# Altium project FAR_SMALL.PrjPcb
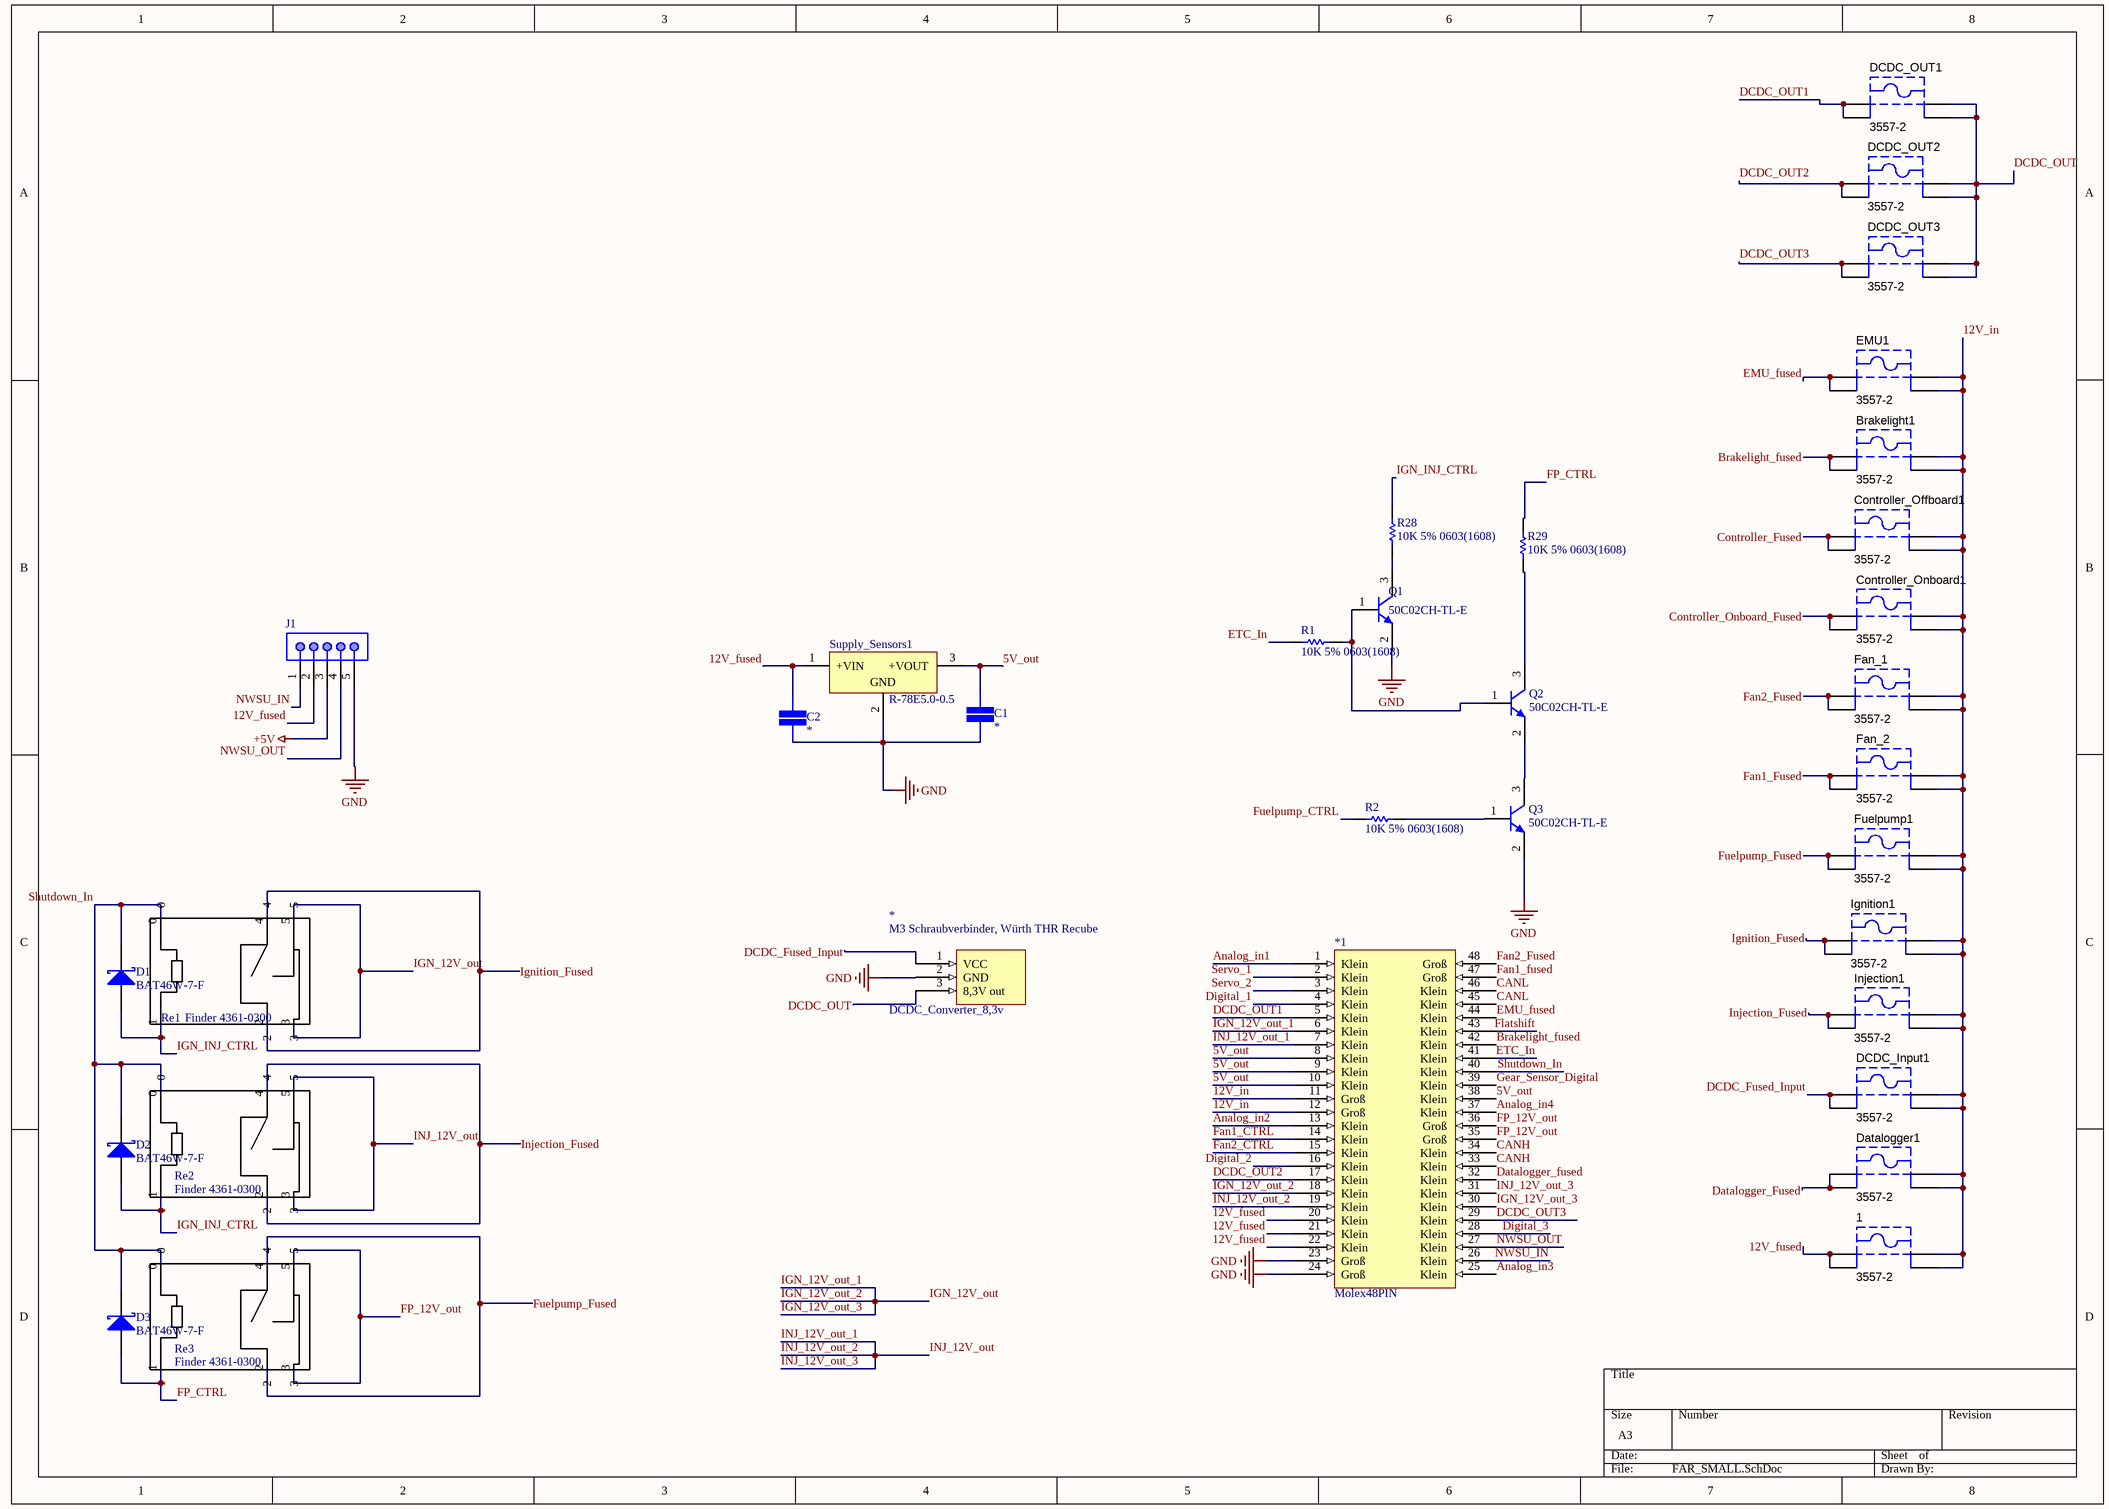
[diagram p0: FAR_SMALL.SchDoc]
3 sheets, 99 parts. Net scope: global (net labels, ports and power ports of the same name join across sheets).
Board file: FAR_Small_PCB_V1_0.PcbDoc
Sheets:
  FAR_SMALL.SchDoc
  Fused_Inputs.SchDoc
  Controller.SchDoc

## Sheet FAR_SMALL.SchDoc
size A3

### Parts
1  3557-2  [KSTN-3557-2]
*  DCDC_Converter_8,3v  [DCDC_BR_8,3V]
*1  Molex48PIN  [PCBComponent_1]
Brakelight1  3557-2  [KSTN-3557-2]
C1  SMD Capacitor  [CAP 0603/1608]  (value not drawn)
C2  SMD Capacitor  [CAP 0603/1608]  (value not drawn)
Controller_Offboard1  3557-2  [KSTN-3557-2]
Controller_Onboard1  3557-2  [KSTN-3557-2]
D1  BAT46W-7-F  [DIOD-SOD-123-2_V]
D2  BAT46W-7-F  [DIOD-SOD-123-2_V]
D3  BAT46W-7-F  [DIOD-SOD-123-2_V]
Datalogger1  3557-2  [KSTN-3557-2]
DCDC_Input1  3557-2  [KSTN-3557-2]
DCDC_OUT1  3557-2  [KSTN-3557-2]
DCDC_OUT2  3557-2  [KSTN-3557-2]
DCDC_OUT3  3557-2  [KSTN-3557-2]
EMU1  3557-2  [KSTN-3557-2]
Fan_1  3557-2  [KSTN-3557-2]
Fan_2  3557-2  [KSTN-3557-2]
Fuelpump1  3557-2  [KSTN-3557-2]
Ignition1  3557-2  [KSTN-3557-2]
Injection1  3557-2  [KSTN-3557-2]
J1  61300511121  [61300511121]  (value not drawn)
Q1  50C02CH-TL-E  [ONSC-CPH-3_V]
Q2  50C02CH-TL-E  [ONSC-CPH-3_V]
Q3  50C02CH-TL-E  [ONSC-CPH-3_V]
R1  10K 5% 0603(1608)  [RESC0603(1608)_N]
R2  10K 5% 0603(1608)  [RESC0603(1608)_N]
R28  10K 5% 0603(1608)  [RESC0603(1608)_N]
R29  10K 5% 0603(1608)  [RESC0603(1608)_N]
Re1  Finder 4361-0300  [Finder 436190120300]
Re2  Finder 4361-0300  [Finder 436190120300]
Re3  Finder 4361-0300  [Finder 436190120300]
Supply_Sensors1  R-78E5.0-0.5  [REPO-R-78E-0.5-3_V]

### Nets
+5V: J1.3
GND: *.2(GND) *1.23(Groß) *1.24(Groß) C1.1 C2.1 J1.5 Q1.2(E) Q3.2(E) Supply_Sensors1.2(GND)
5V_out: *1.8(Klein) *1.9(Klein) *1.10(Klein) *1.38(Klein) C1.2 Supply_Sensors1.3(+VOUT)
12V_fused: 1.1 1.2 *1.20(Klein) *1.21(Klein) *1.22(Klein) C2.2 J1.2 Supply_Sensors1.1(+VIN)
12V_in: 1.3 1.4 *1.11(Groß) *1.12(Groß) Brakelight1.3 Brakelight1.4 Controller_Offboard1.3 Controller_Offboard1.4 Controller_Onboard1.3 Controller_Onboard1.4 Datalogger1.3 Datalogger1.4 DCDC_Input1.3 DCDC_Input1.4 EMU1.3 EMU1.4 Fan_1.3 Fan_1.4 Fan_2.3 Fan_2.4 Fuelpump1.3 Fuelpump1.4 Ignition1.3 Ignition1.4 Injection1.3 Injection1.4
Analog_in1: *1.1(Klein)
Analog_in2: *1.13(Klein)
Analog_in3: *1.25(Klein)
Analog_in4: *1.37(Klein)
Brakelight_fused: *1.42(Klein) Brakelight1.1 Brakelight1.2
CANH: *1.33(Klein) *1.34(Klein)
CANL: *1.45(Klein) *1.46(Klein)
Controller_Fused: Controller_Offboard1.1 Controller_Offboard1.2
Controller_Onboard_Fused: Controller_Onboard1.1 Controller_Onboard1.2
Datalogger_Fused: *1.32(Klein) Datalogger1.1 Datalogger1.2
DCDC_Fused_Input: *.1(VCC) DCDC_Input1.1 DCDC_Input1.2
DCDC_OUT: *.3(8,3V_out) DCDC_OUT1.3 DCDC_OUT1.4 DCDC_OUT2.3 DCDC_OUT2.4 DCDC_OUT3.3 DCDC_OUT3.4
DCDC_OUT1: *1.5(Klein) DCDC_OUT1.1 DCDC_OUT1.2
DCDC_OUT2: *1.17(Klein) DCDC_OUT2.1 DCDC_OUT2.2
DCDC_OUT3: *1.29(Klein) DCDC_OUT3.1 DCDC_OUT3.2
Digital_1: *1.4(Klein)
Digital_2: *1.16(Klein)
Digital_3: *1.28(Klein)
EMU_fused: *1.44(Klein) EMU1.1 EMU1.2
ETC_In: *1.41(Klein) R1.1
Fan1_CTRL: *1.14(Klein)
Fan1_Fused: *1.47(Groß) Fan_2.1 Fan_2.2
Fan2_CTRL: *1.15(Klein)
Fan2_Fused: *1.48(Groß) Fan_1.1 Fan_1.2
Flatshift: *1.43(Klein)
FP_12V_out: *1.35(Groß) *1.36(Groß) Re3.3 Re3.5
FP_CTRL: D3.1(A) R29.2 Re3.1
Fuelpump_CTRL: R2.1
Fuelpump_Fused: Fuelpump1.1 Fuelpump1.2 Re3.2 Re3.4
Gear_Sensor_Digital: *1.39(Klein)
IGN_12V_out: *1.6(Klein) *1.18(Klein) *1.30(Klein) Re1.3 Re1.5  [also labelled IGN_12V_out_1, IGN_12V_out_2, IGN_12V_out_3]
IGN_INJ_CTRL: D1.1(A) D2.1(A) R28.2 Re1.1 Re2.1
Ignition_Fused: Ignition1.1 Ignition1.2 Re1.2 Re1.4
INJ_12V_out: *1.7(Klein) *1.19(Klein) *1.31(Klein) Re2.3 Re2.5  [also labelled INJ_12V_out_1, INJ_12V_out_2, INJ_12V_out_3]
Injection_Fused: Injection1.1 Injection1.2 Re2.2 Re2.4
NWSU_IN: *1.26(Klein) J1.1
NWSU_OUT: *1.27(Klein) J1.4
Servo_1: *1.2(Klein)
Servo_2: *1.3(Klein)
Shutdown_In: *1.40(Klein) D1.2(K) D2.2(K) D3.2(K) Re1.0 Re2.0 Re3.0
NetQ1_1: Q1.1(B) Q2.1(B) R1.2
NetQ1_3: Q1.3(C) R28.1
NetQ2_2: Q2.2(E) Q3.3(C)
NetQ2_3: Q2.3(C) R29.1
NetQ3_1: Q3.1(B) R2.2

### Notes on the sheet
- (in symbol DCDC_Converter_8,3v) M3 Schraubverbinder, Würth THR Recube

### Library data of the parts
1 Brakelight1 Controller_Offboard1 Controller_Onboard1 Datalogger1 DCDC_Input1 DCDC_OUT1-DCDC_OUT3 EMU1 Fan_1 Fan_2 Fuelpump1 Ignition1 Injection1 = CMP-2000-05461-1: FUSE HOLDER, PCB MOUNT, 500VAC, 20A, ROHS; Manufacturer: Keystone-Electronics; Number of Circuits: 1; Voltage: 500V; Fuseholder Type: Block; Fuse Type: Blade; Fuse Size: 0.43"Lx0.15"Wx0.64"H(10.92mmx3.81mmx16.25mm); For Use With/Related Products: ATC,ATO257,MINI897; Current Rating: 30A; Datasheet URL: http://datasheet.octopart.com/3557-2-Keystone-datasheet-15715937.pdf; Orientation: Vertical; Family: Fuseholders; Datasheet Version: Apr-13; Contact Finish: TinNickel; Mounting Type: PCB; Series: -; Category: CircuitProtection; Termination Style: PCPin; Contact Material: Brass; Manufacturer URL: http://www.keyelco.com/
C1 C2 = SMD Capacitor: Capacitor with multiple Footprints; Value: *
D1-D3 = CMP-0303-00004-1: Surface Mount Schottky Barrier Diode, 100 V, -55 to 125 degC, 2-Pin SOD123, RoHS, Tape and Reel; Manufacturer: Diodes Inc; IR@1.5 V: 0.3 uA Max.; V(BR)R: 100 V Min.; VF@10 mA: 0.45 V Max.; CT@1 V: 12 pF Typ.; PartNumber: BAT46W-7-F; ComponentLink1URL: http://www.diodes.com/; ComponentLink3URL: http://diodes.com/datasheets/ds30044.pdf; PackageDescription: 2-Pin SMD, Body 2.7 x 1.55 mm, Height 1.45 mm; ComponentLink2Description: Datasheet; ComponentLink3Description: Package Specification; Mounting Technology: Surface Mount; ComponentLink1Description: Manufacturer URL; RoHS: TRUE; Operating Temperature: -55 to 125 degC; Packing: Tape and Reel; ComponentLink2URL: http://diodes.com/datasheets/ds30044.pdf; DatasheetVersion: Rev. 16-2
J1 = 61300511121: WR-PHD Pin Header, THT, pitch 2.54mm, Single Row, Vertical, 5pin; Pin Number: 5; Gender: Male; Rated Current: 3A; Working Voltage: 250VAC; Withstanding Voltage: 500VAC; Contact Resistance: 20mOhm; ComponentLink1Description: Manufacturer; ComponentLink1URL: http://www.we-online.de; ComponentLink2Description: Datasheet; ComponentLink2URL: https://katalog.we-online.de/em/datasheet/6130xx11121.pdf; Part Number: 61300511121; Published Date: June 2019; Publisher: Wurth Elektronik; Pitch: 2.54mm; Operating Temperature: -40 to +105degC; Mounting Technology: THT; Packaging: Bag; Row Number: Single; Orientation: Vertical
Q1-Q3 = CMP-1048-00075-1: Bipolar Transistor, 50 V, 0.5 A, Low VCE(sat), NPN Single, 3-Pin CPH, Pb-Free, Tape and Reel; Manufacturer: On Semiconductor; IC Continuous (A): 0.5; Polarity: NPN; ComponentLink2Description: Datasheet; ComponentLink1URL: http://www.onsemi.com/; PartNumber: 50C02CH-TL-E; ComponentLink1Description: Manufacturer URL; PackageReference: CPH-3; Mounting Technology: Surface Mount; ComponentLink2URL: http://www.onsemi.com/pub_link/Collateral/50C02CH-D.PDF; PackageDescription: 3-Pin Small Outline Transistor, Body 2.9 x 1.6 mm, Pitch 0.95 mm; ComponentLink3Description: Package Specification; ComponentLink3URL: http://www.onsemi.com/pub_link/Collateral/50A02CH-D.PDF; Packing: Tape and Reel; RoHS: TRUE
R1 R2 R28 R29 = CMP-1012-00098-1: 10K 0.1W 5% 0603 (1608 Metric)  SMD; Case-EIA: 0603; Value: 10000.00 Ohm; Case-Metric: 1608; Technology: SMT; Tolerance: 5 %; Power: 0.1 W
Re1-Re3 = Finder 4361-0300: 1 Schließer, 16A; pin to pad: 0>1 1>2 2>3 3>4 4>5 5>6
Supply_Sensors1 = CMP-2000-06922-2: DC/DC-Converter, 5 V Single Output, 500 mA, -40 to 85 degC, 3-Pin THD, RoHS, Tube; Manufacturer: Recom Power; Efficiency: 92%; Number of Outputs: 1; Current - Output (Max): 500mA; VIN Min: 7V; Package Version: Rev. 0; VIN Max: 28V; VOUT: 5V; Manufacturer URL: http://www.recom-power.com/us/americas/home.html; Operating Temperature: -40°C~85°C; Datasheet Version: 01/2017; Packaging: Tube; Package Reference: SIP Module; Datasheet URL: http://www.recom-power.com/pdf/Innoline/R-78Exx-0.5.pdf; Package Description: 3-Pin Through Hole Device, Body 11.6 x 8.5 mm, Pitch 2.54 mm; Mounting Technology: ThroughHole

## Sheet Fused_Inputs.SchDoc
size A4
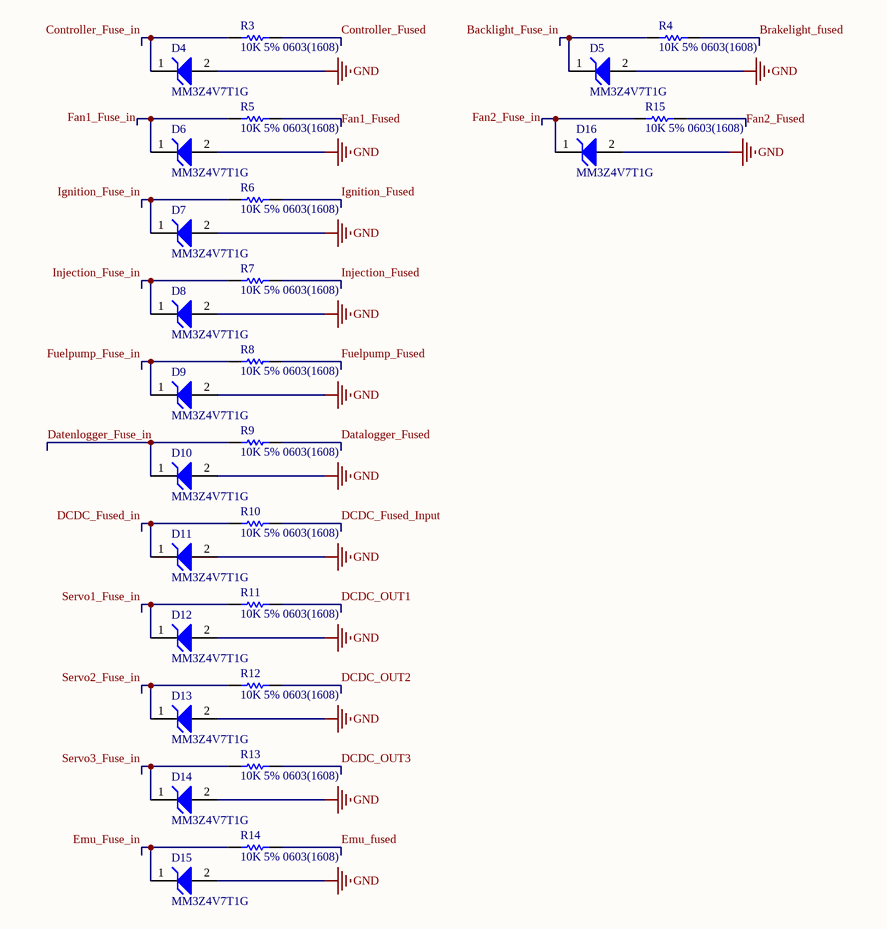
[diagram p1: Fused_Inputs.SchDoc]

### Parts
D4  MM3Z4V7T1G  [ONSC-SOD-323-2-477-02_V]
D5  MM3Z4V7T1G  [ONSC-SOD-323-2-477-02_V]
D6  MM3Z4V7T1G  [ONSC-SOD-323-2-477-02_V]
D7  MM3Z4V7T1G  [ONSC-SOD-323-2-477-02_V]
D8  MM3Z4V7T1G  [ONSC-SOD-323-2-477-02_V]
D9  MM3Z4V7T1G  [ONSC-SOD-323-2-477-02_V]
D10  MM3Z4V7T1G  [ONSC-SOD-323-2-477-02_V]
D11  MM3Z4V7T1G  [ONSC-SOD-323-2-477-02_V]
D12  MM3Z4V7T1G  [ONSC-SOD-323-2-477-02_V]
D13  MM3Z4V7T1G  [ONSC-SOD-323-2-477-02_V]
D14  MM3Z4V7T1G  [ONSC-SOD-323-2-477-02_V]
D15  MM3Z4V7T1G  [ONSC-SOD-323-2-477-02_V]
D16  MM3Z4V7T1G  [ONSC-SOD-323-2-477-02_V]
R3  10K 5% 0603(1608)  [RESC0603(1608)_N]
R4  10K 5% 0603(1608)  [RESC0603(1608)_N]
R5  10K 5% 0603(1608)  [RESC0603(1608)_N]
R6  10K 5% 0603(1608)  [RESC0603(1608)_N]
R7  10K 5% 0603(1608)  [RESC0603(1608)_N]
R8  10K 5% 0603(1608)  [RESC0603(1608)_N]
R9  10K 5% 0603(1608)  [RESC0603(1608)_N]
R10  10K 5% 0603(1608)  [RESC0603(1608)_N]
R11  10K 5% 0603(1608)  [RESC0603(1608)_N]
R12  10K 5% 0603(1608)  [RESC0603(1608)_N]
R13  10K 5% 0603(1608)  [RESC0603(1608)_N]
R14  10K 5% 0603(1608)  [RESC0603(1608)_N]
R15  10K 5% 0603(1608)  [RESC0603(1608)_N]

### Nets
GND: D4.2(A) D5.2(A) D6.2(A) D7.2(A) D8.2(A) D9.2(A) D10.2(A) D11.2(A) D12.2(A) D13.2(A) D14.2(A) D15.2(A) D16.2(A)
Backlight_Fuse_in: D5.1(K) R4.1
Brakelight_fused: R4.2
Controller_Fuse_in: D4.1(K) R3.1
Controller_Fused: R3.2
Datalogger_Fused: R9.2
Datenlogger_Fuse_in: D10.1(K) R9.1
DCDC_Fused_in: D11.1(K) R10.1
DCDC_Fused_Input: R10.2
DCDC_OUT1: R11.2
DCDC_OUT2: R12.2
DCDC_OUT3: R13.2
Emu_Fuse_in: D15.1(K) R14.1
EMU_fused: R14.2
Fan1_Fuse_in: D6.1(K) R5.1
Fan1_Fused: R5.2
Fan2_Fuse_in: D16.1(K) R15.1
Fan2_Fused: R15.2
Fuelpump_Fuse_in: D9.1(K) R8.1
Fuelpump_Fused: R8.2
Ignition_Fuse_in: D7.1(K) R6.1
Ignition_Fused: R6.2
Injection_Fuse_in: D8.1(K) R7.1
Injection_Fused: R7.2
Servo1_Fuse_in: D12.1(K) R11.1
Servo2_Fuse_in: D13.1(K) R12.1
Servo3_Fuse_in: D14.1(K) R13.1

### Library data of the parts
D4-D16 = CMP-1060-00657-1: Zener Voltage Regulator, 300 mW, 2-Pin SOD-323, Pb-Free, Tape and Reel; Manufacturer: On Semiconductor; VZ Typ (V): 4.7; P Max (W): 0.3; ComponentLink1Description: Manufacturer URL; PackageVersion: Rev. H, 03/2007; RoHS: Pb-Free; PackageReference: SOD-323-2-477-02; DatasheetVersion: Rev. 9; ComponentLink1URL: http://www.onsemi.com/; ComponentLink2Description: Datasheet; PartNumber: MM3Z4V7T1G; Mounting Technology: Surface Mount; ComponentLink2URL: http://www.onsemi.cn/pub_link/Collateral/MM3Z2V4T1-D.PDF; PackageDescription: 2-Pin SOD, Body 1.7 x 1.25 mm; Packing: Tape and Reel; ComponentLink3Description: Package Specification; ComponentLink3URL: http://www.onsemi.com/pub_link/Collateral/477-02.PDF.1
R3-R15 = CMP-1012-00098-1: as R1 on sheet FAR_SMALL; Technology: SMT; Tolerance: 5 %; Power: 0.1 W

## Sheet Controller.SchDoc
size A3
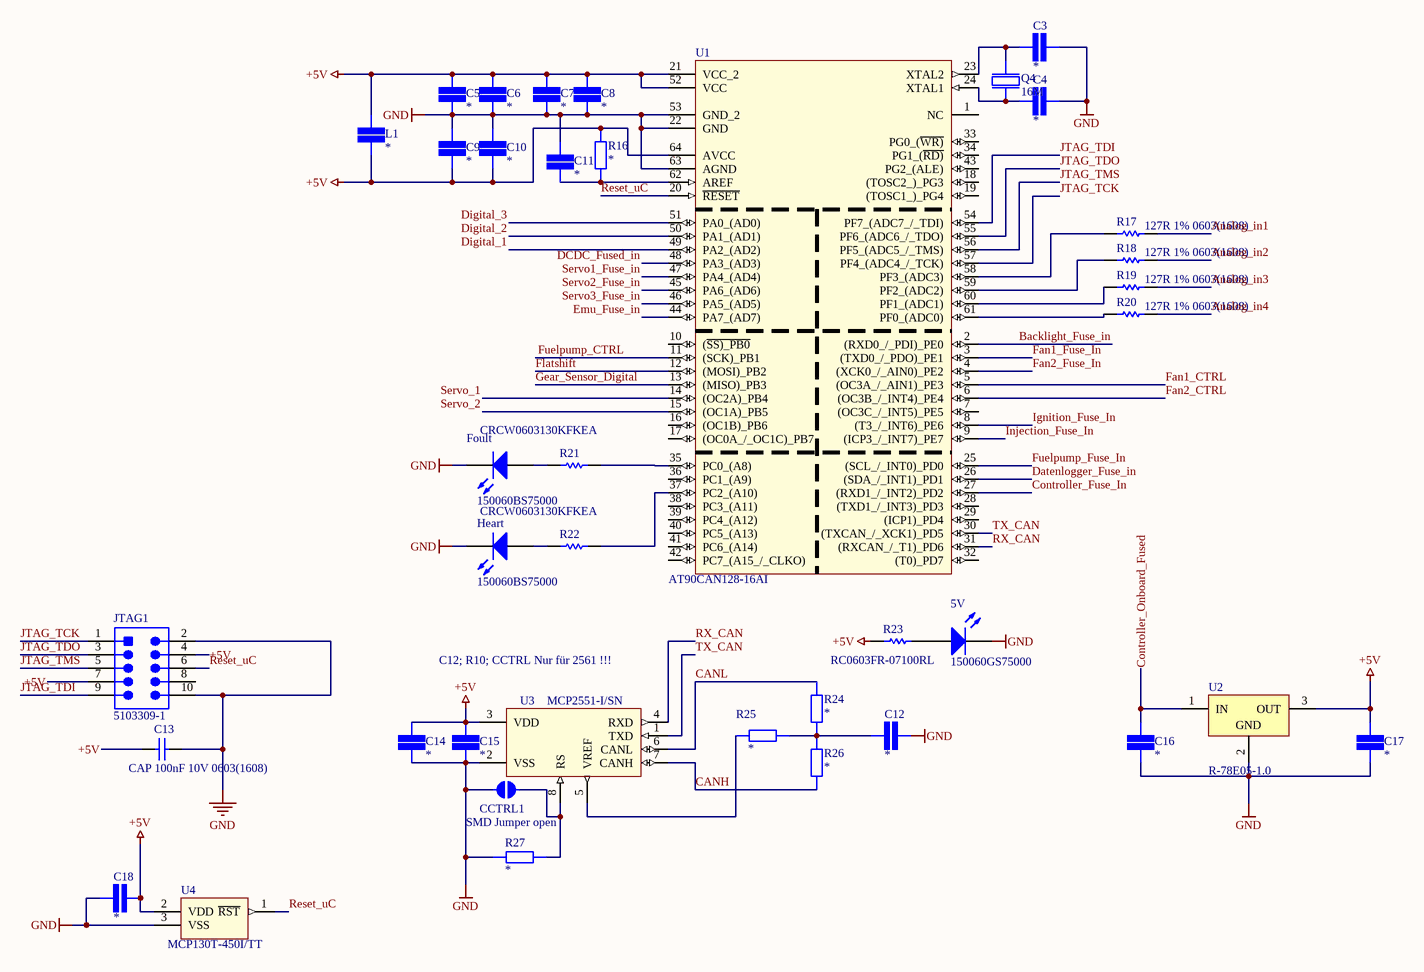
[diagram p2: Controller.SchDoc]

### Parts
5V  150060GS75000  [0603_A]
C3  SMD Capacitor  [CAP 0603/1608]  (value not drawn)
C4  SMD Capacitor  [CAP 0603/1608]  (value not drawn)
C5  SMD Capacitor  [CAP 0603/1608]  (value not drawn)
C6  SMD Capacitor  [CAP 0603/1608]  (value not drawn)
C7  SMD Capacitor  [CAP 0603/1608]  (value not drawn)
C8  SMD Capacitor  [CAP 0603/1608]  (value not drawn)
C9  SMD Capacitor  [CAP 0603/1608]  (value not drawn)
C10  SMD Capacitor  [CAP 0603/1608]  (value not drawn)
C11  SMD Capacitor  [CAP 0603/1608]  (value not drawn)
C12  SMD Capacitor  [CAP 0603/1608]  (value not drawn)
C13  CAP 100nF 10V 0603(1608)  [CAPC0603(1608)100_L]
C14  SMD Capacitor  [CAP 0603/1608]  (value not drawn)
C15  SMD Capacitor  [CAP 0603/1608]  (value not drawn)
C16  SMD Capacitor  [CAP 0603/1608]  (value not drawn)
C17  SMD Capacitor  [CAP 0603/1608]  (value not drawn)
C18  SMD Capacitor  [CAP 0603/1608]  (value not drawn)
CCTRL1  SMD Jumper open  [SMD-JUMPER-OPEN]  (no BOM)
Foult  150060BS75000  [0603_A]
Heart  150060BS75000  [0603_A]
JTAG1  5103309-1  [TECO-5103309-1_V]
L1  SMD Capacitor  [CAP 0603/1608]  (value not drawn)
Q4  16M  [NDK NX5032GA]
R16  SMD Resistor  [STACKPOLE CSR0603]  (value not drawn)
R17  127R 1% 0603(1608)  [RESC0603(1608)_N]
R18  127R 1% 0603(1608)  [RESC0603(1608)_N]
R19  127R 1% 0603(1608)  [RESC0603(1608)_N]
R20  127R 1% 0603(1608)  [RESC0603(1608)_N]
R21  CRCW0603130KFKEA  [RESC1609X50X30NL10T20]
R22  CRCW0603130KFKEA  [RESC1609X50X30NL10T20]
R23  RC0603FR-07100RL  [RESC1608X55X25ML10T15]
R24  SMD Resistor  [STACKPOLE CSR0603]  (value not drawn)
R25  SMD Resistor  [STACKPOLE CSR0603]  (value not drawn)
R26  SMD Resistor  [STACKPOLE CSR0603]  (value not drawn)
R27  SMD Resistor  [STACKPOLE CSR0603]  (value not drawn)
U1  AT90CAN128-16AI  [*QFP80P1600X1600X120-64N]
U2  R-78E05-1.0  [SIP3_RECOM]
U3  MCP2551-I/SN  [*SOIC127P600X175-8N]
U4  MCP130T-450I/TT  [*SOT95P237X112-3N]

### Nets
+5V: C5.2 C6.2 C7.2 C8.2 C9.1 C10.1 C13.1 C14.2 C15.2 C17.2 C18.1 JTAG1.4 JTAG1.7 L1.1 L1.2 R16.2 R23.1 U1.21(VCC_2) U1.52(VCC) U1.64(AVCC) U2.3(OUT) U3.3(VDD) U4.2(VDD)
GND: 5V.1(K) C3.1 C4.1 C5.1 C6.1 C7.1 C8.1 C9.2 C10.2 C11.2 C12.2 C13.2 C14.1 C15.1 C16.1 C17.1 C18.2 CCTRL1.1 Foult.1(K) Heart.1(K) JTAG1.2 JTAG1.10 R27.1 U1.22(GND) U1.53(GND_2) U1.63(AGND) U2.2(GND) U3.2(VSS) U4.3(VSS)
Analog_in1: R17.1
Analog_in2: R18.1
Analog_in3: R19.1
Analog_in4: R20.1
Backlight_Fuse_in: U1.2((RXD0_/_PDI)_PE0)
CANH: R26.2 U3.7(CANH)
CANL: R24.1 U3.6(CANL)
Controller_Fuse_in: U1.27((RXD1_/_INT2)_PD2)
Controller_Onboard_Fused: C16.2 U2.1(IN)
Datenlogger_Fuse_in: U1.26((SDA_/_INT1)_PD1)
DCDC_Fused_in: U1.48(PA3_(AD3))
Digital_1: U1.49(PA2_(AD2))
Digital_2: U1.50(PA1_(AD1))
Digital_3: U1.51(PA0_(AD0))
Emu_Fuse_in: U1.44(PA7_(AD7))
Fan1_CTRL: U1.5((OC3A_/_AIN1)_PE3)
Fan1_Fuse_in: U1.3((TXD0_/_PDO)_PE1)
Fan2_CTRL: U1.6((OC3B_/_INT4)_PE4)
Fan2_Fuse_in: U1.4((XCK0_/_AIN0)_PE2)
Flatshift: U1.12((MOSI)_PB2)
Fuelpump_CTRL: U1.11((SCK)_PB1)
Fuelpump_Fuse_in: U1.25((SCL_/_INT0)_PD0)
Gear_Sensor_Digital: U1.13((MISO)_PB3)
Ignition_Fuse_in: U1.8((T3_/_INT6)_PE6)
Injection_Fuse_in: U1.9((ICP3_/_INT7)_PE7)
JTAG_TCK: JTAG1.1 U1.57(PF4_(ADC4_/_TCK))
JTAG_TDI: JTAG1.9 U1.54(PF7_(ADC7_/_TDI))
JTAG_TDO: JTAG1.3 U1.55(PF6_(ADC6_/_TDO))
JTAG_TMS: JTAG1.5 U1.56(PF5_(ADC5_/_TMS))
Reset_uC: JTAG1.6 U1.20(~{RESET}) U4.1(~{RST})
RX_CAN: U1.31((RXCAN_/_T1)_PD6) U3.4(RXD)
Servo1_Fuse_in: U1.47(PA4_(AD4))
Servo2_Fuse_in: U1.45(PA6_(AD6))
Servo3_Fuse_in: U1.46(PA5_(AD5))
Servo_1: U1.14((OC2A)_PB4)
Servo_2: U1.15((OC1A)_PB5)
TX_CAN: U1.30((TXCAN_/_XCK1)_PD5) U3.1(TXD)
Net5V_2: 5V.2(A) R23.2
NetC3_2: C3.2 Q4.2 U1.23(XTAL2)
NetC4_2: C4.2 Q4.1 U1.24(XTAL1)
NetC11_1: C11.1 R16.1 U1.62(AREF)
NetC12_1: C12.1 R24.2 R25.2 R26.1
NetCCTRL1_2: CCTRL1.2 R27.2 U3.8(RS)
NetFoult_2: Foult.2(A) R21.2
NetHeart_2: Heart.2(A) R22.2
NetR17_2: R17.2 U1.58(PF3_(ADC3))
NetR18_2: R18.2 U1.59(PF2_(ADC2))
NetR19_2: R19.2 U1.60(PF1_(ADC1))
NetR20_2: R20.2 U1.61(PF0_(ADC0))
NetR21_1: R21.1 U1.35(PC0_(A8))
NetR22_1: R22.1 U1.37(PC2_(A10))
NetR25_1: R25.1 U3.5(VREF)

Not connected (* = marked no-connect by the designer): JTAG1 8; U1 1(NC) 7((OC3C_/_INT5)_PE5) 10((~{SS)_PB0}) 16((OC1B)_PB6) 17((OC0A_/_OC1C)_PB7) 18((TOSC2_)_PG3) 19((TOSC1_)_PG4) 28((TXD1_/_INT3)_PD3) 29((ICP1)_PD4) 32((T0)_PD7) 33(PG0_(~{WR)}) 34(PG1_(~{RD)}) 36(PC1_(A9)) 38(PC3_(A11)) 39(PC4_(A12)) 40(PC5_(A13)) 41(PC6_(A14)) 42(PC7_(A15_/_CLKO)) 43(PG2_(ALE))

### Notes on the sheet
- C12; R10; CCTRL Nur für 2561 !!!

### Library data of the parts
5V = CMP-1426-00002-1: SMD mono-color Chip LED, WL-SMCW, Green; Manufacturer: Wuerth Elektronik; ComponentLink1URL: http://www.we-online.com; ComponentLink2Description: Datasheet; Color: Green; ComponentLink2URL: http://katalog.we-online.com/led/datasheet/150060GS75000.pdf; PartNumber: 150060GS75000; PackageReference: 0603_A; ComponentLink1Description: Manufacturer URL
C3-C12 C14-C18 L1 = SMD Capacitor: Capacitor with multiple Footprints; Value: *
C13 = CMP-1035-02579-1: CAP 100nF 10V ±5% 0603 (1608 Metric) Thickness 1mm SMD; Tolerance: Â±5%; Case-EIA: 0603; Case-Metric: 1608; Value: 100nF; Max Thickness: 1 mm; Rated Voltage: 10 V; Technology: SMT
Foult Heart = CMP-1426-00003-1: SMD mono-color Chip LED, WL-SMCW, Blue; Manufacturer: Wuerth Elektronik; Color: Blue; ComponentLink2Description: Datasheet; ComponentLink2URL: http://katalog.we-online.com/led/datasheet/150060BS75000.pdf; ComponentLink1URL: http://www.we-online.com; PackageReference: 0603_A; PartNumber: 150060BS75000; ComponentLink1Description: Manufacturer URL
JTAG1 = CMP-2000-07502-1: Male Header, Pitch 2.54 mm, 2 x 5 Position, Height 9.855 mm, Tail Length 3.048 mm, -65 to 105 degC, RoHS, Tube; Manufacturer: TE Connectivity; PCB Mounting Orientation: Vertical; Pitch: 2.54mm; Mating Connector Lock: No(Without); Body Material: Thermoplastic; Shrouded: Yes(With); Connector System: Wire-to-Board; Insulation Resistance: 5GR; Number of Positions: 10; Max Current Rating: 1A; PCB Mount Retention: Without; Manufacturer URL: http://www.te.com/; Contact Plating: Gold; Datasheet URL: http://www.te.com/commerce/DocumentDelivery/DDEController?Action=showdoc&DocId=Customer+Drawing%7F5103309%7FE1%7Fpdf%7FEnglish%7FENG_CD_5103309_E1.pdf%7F5103309-1; Colour: Black; Termination: ThroughHole; Housing Colour: Black; Flammability Rating: UL94V-0; Package Description: Male Header, Pitch 2.54 mm, 2 x 5 Position, Height 9.855 mm, Tail Length 3.048 mm; Mating Retention: No(Without); Orientation: Straight; Row Spacing: 2.54mm; Termination Post Length: 0.12inch; Min Operating Temperature: -65degC; Board Standoff: Yes(With); REACH SVHC: NoSVHC; Depth: 9.14mm; Lead Free: LeadFree; Gender: Male; Connector Type: Header; Shrouded End Dimension: 3.81mm; ELV: Compliant; Mating Alignment: Yes(With); Panel Mount Retention: No(Without); Package Quantity: 35; PCB Mount Alignment: No(Without); Number of Rows: 2; Package Reference: 5103309-1; Mounting Technology: ThroughHole; Mount: ThroughHole; Contact Gender: Male; Number of Contacts: 10; Length: 0.8inch; Current Rating: 1A; Contact Mating Length: 0.24inch; Max Operating Temperature: 105degC; RoHSCompliant: True; Datasheet Version: Rev. E1, 03/2011; Contact Shape: Square; Height: 8.813mm; Housing Material: PBT; Contact Material: CopperAlloy; Packaging: Rail/Tube
Q4 = 16 MHz Quartz
R16 R24-R27 = SMD Resistor: Resistor with multiple footprints; Value: *
R17-R20 = CMP-1012-00408-1: 127R 0.1W 1% 0603 (1608 Metric)  SMD; Case-Metric: 1608; Value: 127.00 Ohm; Case-EIA: 0603; Power: 0.1 W; Tolerance: 1 %; Technology: SMT
R21 R22 = CMP-2000-03887-1: Manufacturer: Vishay Dale; Part Number: CRCW0603130KFKEA
R23 = CMP-2100-03663-1: Chip Resistor, 100 Ohm, +/- 1%, 0.1 W, -55 to 155 degC, 0603 (1608 Metric), RoHS, Tape and Reel; Manufacturer: Yageo; Voltage Rating (DC): 50V; Power Rating: 100mW; Resistance: 100Ohm; Temperature Coefficient: 100ppm/degreesC; Number of Pins: 2; Tolerance: 1%; Height: 0.45mm; Manufacturer URL: http://www.yageo.com/; Military Standard: Not; Datasheet URL: http://www.yageo.com/NewPortal/yageodocoutput?fileName=/pdf/R-Chip/PYu-RC_Group_51_RoHS_L_5.pdf; Case Code (Imperial): 0603; Termination: SMD/SMT; Lead Free: LeadFree; Max Operating Temperature: 155degC; Case Code (Metric): 1608; RoHSCompliant: true; Voltage Rating: 50V; Width: 0.8mm; Composition: ThickFilm; Depth: 0.8mm; REACH SVHC: Unknown; Min Operating Temperature: -55degC; Packaging: TapeandReel; Package Description: 2-Pin Surface Mount Device, Body 1.6 x 0.8 mm; Length: 1.6mm; Package Reference: 0603; Datasheet Version: Rev. 5, 10/2016; Case/Package: 0603
U1 = AT90CAN128-16AI: Ic Mcu 8bit 128kb Flash 64tqfp; MF: Microchip; MP: AT90CAN128-16AI; Package: TQFP-64 Microchip; SnapEDA_Link: https://www.snapeda.com/parts/AT90CAN128-16AI/Microchip/view-part/?ref=snap; Price: None; Availability: Unavailable; Value: *
U2 = R-78E05-1.0: Nonisolated 5V Switchmode converter
U3 = MCP2551-I/SN: MCP2551 Series 5.5 V 1 Mb/s Surface Mount High-Speed CAN Transceiver - SOIC-8; MF: Microchip; MP: MCP2551-I/SN; SnapEDA_Link: https://www.snapeda.com/parts/MCP2551-I/SN/Microchip/view-part/?ref=snap; Price: None; Package: SOIC-8 Microchip; Availability: Unavailable; Value: *
U4 = MCP130T-450I/TT: System Supervisors - Power Supply Monitors with Reset Generators Open Drain Low; MF: Microchip; MP: MCP120T-450I/TT; Price: None; SnapEDA_Link: https://www.snapeda.com/parts/MCP120T-450I/TT/Microchip/view-part/?ref=snap; Package: SOT-23-3 Microchip; Availability: Unavailable; Value: *

## Nets that join several sheets
+5V: FAR_SMALL (J1.3), Controller (23 pins)
GND: FAR_SMALL (9 pins), Fused_Inputs (13 pins), Controller (29 pins)
Analog_in1: FAR_SMALL (*1.1), Controller (R17.1)
Analog_in2: FAR_SMALL (*1.13), Controller (R18.1)
Analog_in3: FAR_SMALL (*1.25), Controller (R19.1)
Analog_in4: FAR_SMALL (*1.37), Controller (R20.1)
Backlight_Fuse_in: Fused_Inputs (D5.1 R4.1), Controller (U1.2)
Brakelight_fused: FAR_SMALL (*1.42 Brakelight1.1 Brakelight1.2), Fused_Inputs (R4.2)
CANH: FAR_SMALL (*1.33 *1.34), Controller (R26.2 U3.7)
CANL: FAR_SMALL (*1.45 *1.46), Controller (R24.1 U3.6)
Controller_Fuse_in: Fused_Inputs (D4.1 R3.1), Controller (U1.27)
Controller_Fused: FAR_SMALL (Controller_Offboard1.1 Controller_Offboard1.2), Fused_Inputs (R3.2)
Controller_Onboard_Fused: FAR_SMALL (Controller_Onboard1.1 Controller_Onboard1.2), Controller (C16.2 U2.1)
Datalogger_Fused: FAR_SMALL (*1.32 Datalogger1.1 Datalogger1.2), Fused_Inputs (R9.2)
Datenlogger_Fuse_in: Fused_Inputs (D10.1 R9.1), Controller (U1.26)
DCDC_Fused_in: Fused_Inputs (D11.1 R10.1), Controller (U1.48)
DCDC_Fused_Input: FAR_SMALL (*.1 DCDC_Input1.1 DCDC_Input1.2), Fused_Inputs (R10.2)
DCDC_OUT1: FAR_SMALL (*1.5 DCDC_OUT1.1 DCDC_OUT1.2), Fused_Inputs (R11.2)
DCDC_OUT2: FAR_SMALL (*1.17 DCDC_OUT2.1 DCDC_OUT2.2), Fused_Inputs (R12.2)
DCDC_OUT3: FAR_SMALL (*1.29 DCDC_OUT3.1 DCDC_OUT3.2), Fused_Inputs (R13.2)
Digital_1: FAR_SMALL (*1.4), Controller (U1.49)
Digital_2: FAR_SMALL (*1.16), Controller (U1.50)
Digital_3: FAR_SMALL (*1.28), Controller (U1.51)
Emu_Fuse_in: Fused_Inputs (D15.1 R14.1), Controller (U1.44)
EMU_fused: FAR_SMALL (*1.44 EMU1.1 EMU1.2), Fused_Inputs (R14.2)
Fan1_CTRL: FAR_SMALL (*1.14), Controller (U1.5)
Fan1_Fuse_in: Fused_Inputs (D6.1 R5.1), Controller (U1.3)
Fan1_Fused: FAR_SMALL (*1.47 Fan_2.1 Fan_2.2), Fused_Inputs (R5.2)
Fan2_CTRL: FAR_SMALL (*1.15), Controller (U1.6)
Fan2_Fuse_in: Fused_Inputs (D16.1 R15.1), Controller (U1.4)
Fan2_Fused: FAR_SMALL (*1.48 Fan_1.1 Fan_1.2), Fused_Inputs (R15.2)
Flatshift: FAR_SMALL (*1.43), Controller (U1.12)
Fuelpump_CTRL: FAR_SMALL (R2.1), Controller (U1.11)
Fuelpump_Fuse_in: Fused_Inputs (D9.1 R8.1), Controller (U1.25)
Fuelpump_Fused: FAR_SMALL (Fuelpump1.1 Fuelpump1.2 Re3.2 Re3.4), Fused_Inputs (R8.2)
Gear_Sensor_Digital: FAR_SMALL (*1.39), Controller (U1.13)
Ignition_Fuse_in: Fused_Inputs (D7.1 R6.1), Controller (U1.8)
Ignition_Fused: FAR_SMALL (Ignition1.1 Ignition1.2 Re1.2 Re1.4), Fused_Inputs (R6.2)
Injection_Fuse_in: Fused_Inputs (D8.1 R7.1), Controller (U1.9)
Injection_Fused: FAR_SMALL (Injection1.1 Injection1.2 Re2.2 Re2.4), Fused_Inputs (R7.2)
Servo1_Fuse_in: Fused_Inputs (D12.1 R11.1), Controller (U1.47)
Servo2_Fuse_in: Fused_Inputs (D13.1 R12.1), Controller (U1.45)
Servo3_Fuse_in: Fused_Inputs (D14.1 R13.1), Controller (U1.46)
Servo_1: FAR_SMALL (*1.2), Controller (U1.14)
Servo_2: FAR_SMALL (*1.3), Controller (U1.15)